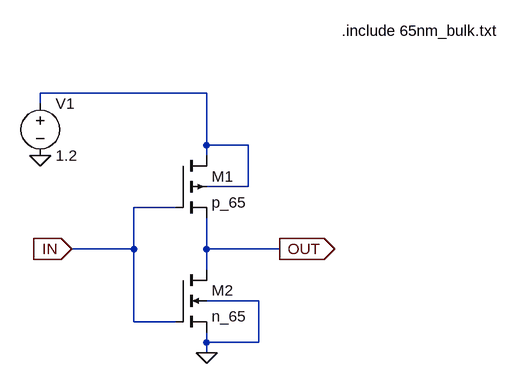
[diagram p0: schematic CMOS_INV.asc]
CMOS_INV.asc, the LTspice schematic file:
Version 4
SHEET 1 888 680
WIRE 432 80 176 80
WIRE 176 96 176 80
WIRE 432 160 432 80
WIRE 496 160 432 160
WIRE 432 176 432 160
WIRE 496 224 496 160
WIRE 496 224 432 224
WIRE 384 256 320 256
WIRE 320 320 320 256
WIRE 320 320 224 320
WIRE 432 320 432 272
WIRE 544 320 432 320
WIRE 432 352 432 320
WIRE 512 400 432 400
WIRE 320 432 320 320
WIRE 384 432 320 432
WIRE 432 464 432 448
WIRE 512 464 512 400
WIRE 512 464 432 464
WIRE 432 480 432 464
FLAG 224 320 IN
IOPIN 224 320 In
FLAG 544 320 OUT
IOPIN 544 320 Out
FLAG 176 176 0
FLAG 432 480 0
SYMBOL pmos4 384 176 R0
SYMATTR InstName M1
SYMATTR Value2 l=65n w=4u
SYMATTR Value p_65
SYMBOL nmos4 384 352 R0
SYMATTR InstName M2
SYMATTR Value2 l=65n w=2u
SYMATTR Value n_65
SYMBOL Voltage 176 80 R0
SYMATTR InstName V1
SYMATTR Value 1.2
TEXT 640 -16 Left 2 !.include 65nm_bulk.txt

The netlist it stands for:
* CMOS_INV.asc
M1 N001 IN OUT N001 p_65 l=65n w=4u
M2 OUT IN 0 0 n_65 l=65n w=2u
V1 N001 0 1.2
.model NMOS NMOS
.model PMOS PMOS
.lib standard.mos
.include 65nm_bulk.txt
.backanno
.end